# Altium project Door Sensor PCB.PrjPcb
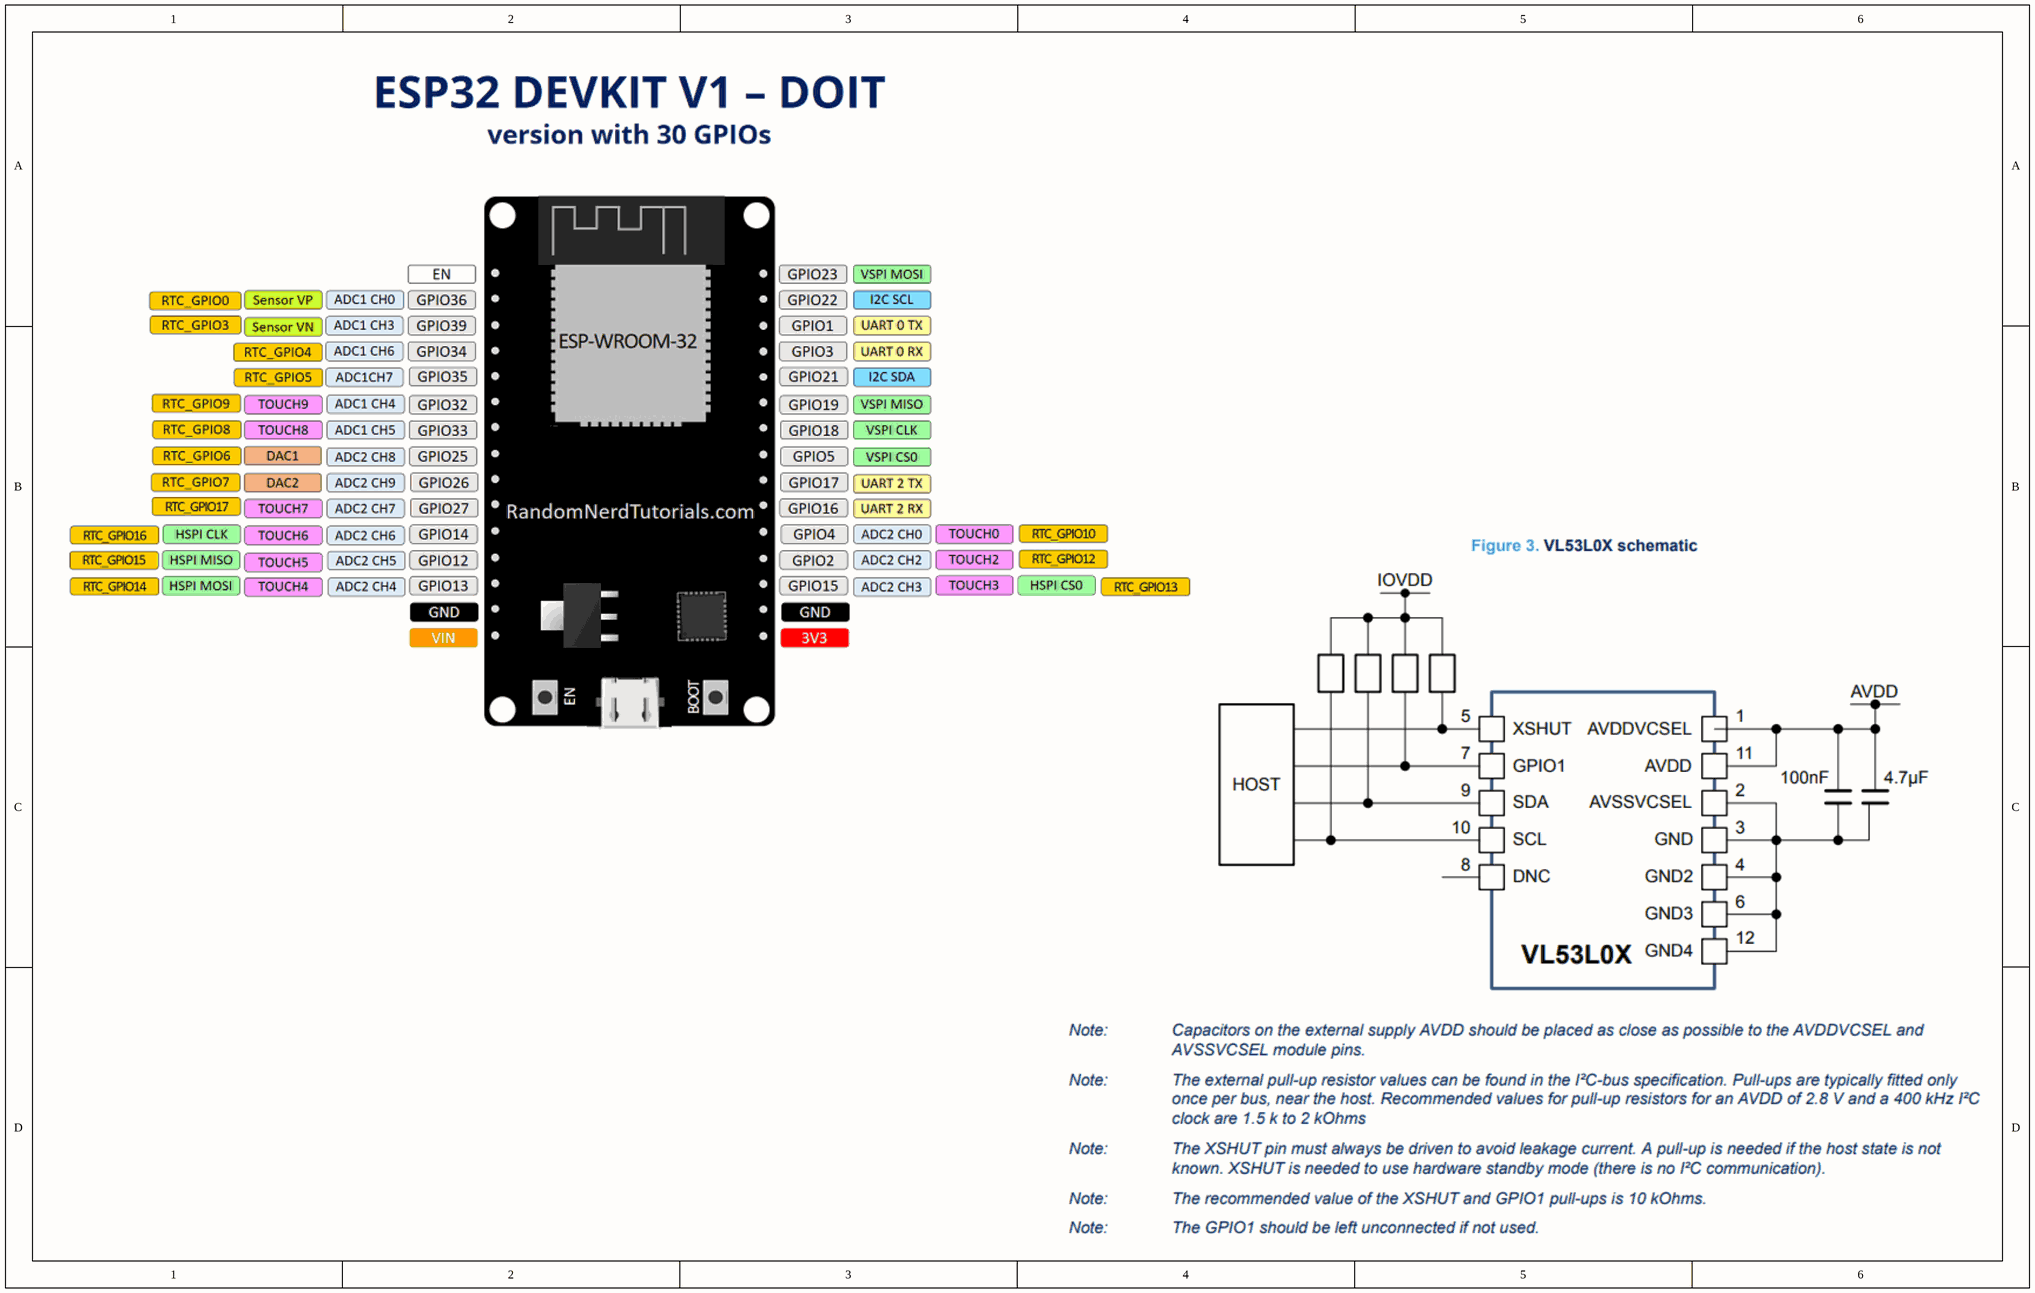
[diagram p0: Overview.SchDoc]
4 sheets, 47 parts. Net scope: global (net labels, ports and power ports of the same name join across sheets).
Board file: main.PcbDoc
Sheets:
  Overview.SchDoc
  ESP32 and Sensor.SchDoc
  Power.SchDoc
  Connections.SchDoc

## Sheet Overview.SchDoc
size B; SheetNumber: 1; SheetTotal: 4

## Sheet ESP32 and Sensor.SchDoc
size B; SheetNumber: 2; SheetTotal: 4
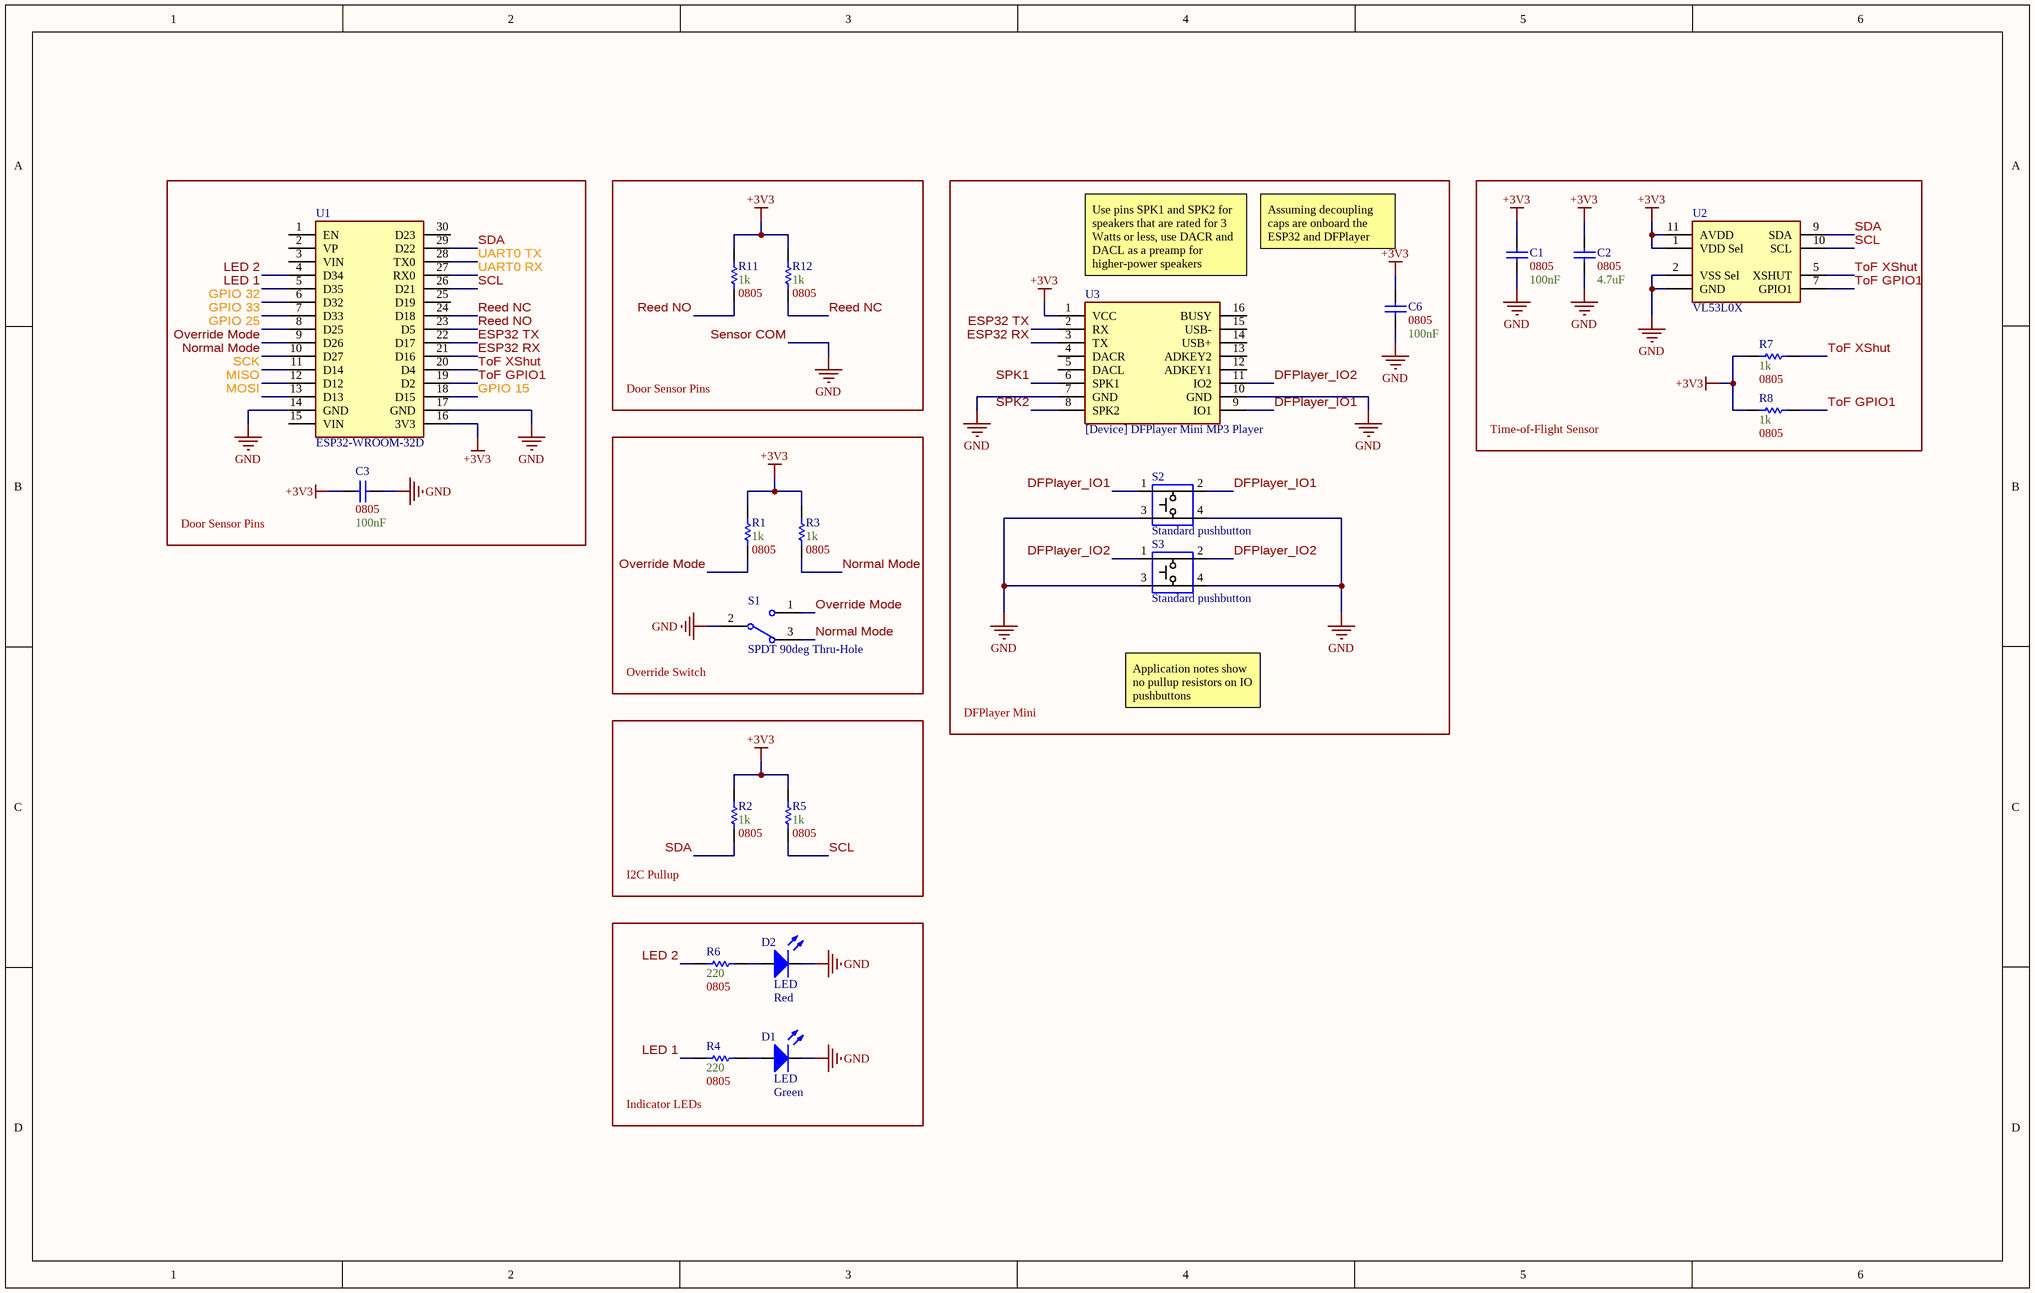
[diagram p1: ESP32 and Sensor.SchDoc]

### Parts
(Parts that share a designator on the sheet are numbered #1, #2 ... from top to bottom, then left to right.)
C1  Size Package: 0805  Capacitance: 100nF  [[Cap] SMD 0805]  (hidden comment: SMD Nonpolarized)
C2  Size Package: 0805  Capacitance: 4.7uF  [[Cap] SMD 0805]  (hidden comment: SMD Nonpolarized)
C3  Size Package: 0805  Capacitance: 100nF  [[Cap] SMD 0805]  (hidden comment: SMD Nonpolarized)
C6#1  Size Package: 0805  Capacitance: 100nF  [[Cap] SMD 0805]  (hidden comment: SMD Nonpolarized)
D1  LED  Color: Green  [[LED] Thru-Hole, 3mm, Green]
D2  LED  Color: Red  [[LED] Thru-Hole, 3mm, Red]
R1  Resistance: 1k  Size Package: 0805  [[Res] SMD 0805]  (hidden comment: [Res] SMD Resistor)
R2  Resistance: 1k  Size Package: 0805  [[Res] SMD 0805]  (hidden comment: [Res] SMD Resistor)
R3  Resistance: 1k  Size Package: 0805  [[Res] SMD 0805]  (hidden comment: [Res] SMD Resistor)
R4  Resistance: 220  Size Package: 0805  [[Res] SMD 0805]  (hidden comment: [Res] SMD Resistor)
R5  Resistance: 1k  Size Package: 0805  [[Res] SMD 0805]  (hidden comment: [Res] SMD Resistor)
R6  Resistance: 220  Size Package: 0805  [[Res] SMD 0805]  (hidden comment: [Res] SMD Resistor)
R7  Resistance: 1k  Size Package: 0805  [[Res] SMD 0805]  (hidden comment: [Res] SMD Resistor)
R8  Resistance: 1k  Size Package: 0805  [[Res] SMD 0805]  (hidden comment: [Res] SMD Resistor)
R11#1  Resistance: 1k  Size Package: 0805  [[Res] SMD 0805]  (hidden comment: [Res] SMD Resistor)
R12#1  Resistance: 1k  Size Package: 0805  [[Res] SMD 0805]  (hidden comment: [Res] SMD Resistor)
S1  SPDT 90deg Thru-Hole  [[Switch] SPDT Toggle Switch 90deg]
S2  Standard pushbutton  [[Switch] Pushbutton]
S3  Standard pushbutton  [[Switch] Pushbutton]
U1  ESP32-WROOM-32D  [[Device] ESP32-WROOM-32D]
U2#1  VL53L0X  [[Device] Time-of-Flight Sensor]
U3  [Device] DFPlayer Mini MP3 Player  [[Device] DFPlayer Mini MP3 Player]

### Blocks framed on the sheet
Door Sensor Pins: C3 U1
Door Sensor Pins: R11#1 R12#1
DFPlayer Mini: C6#1 S2 S3 U3
Time-of-Flight Sensor: C1 C2 R7 R8 U2#1
Override Switch: R1 R3 S1
I2C Pullup: R2 R5
Indicator LEDs: D1 D2 R4 R6

### Nets
+3V3: C1.2 C2.2 C3.2 C6#1.2 R1.2 R2.2 R3.2 R5.2 R7.2 R8.2 R11#1.2 R12#1.2 U1.16(3V3) U2#1.1(VDD_Sel) U2#1.11(AVDD) U3.1(VCC)
GND: C1.1 C2.1 C3.1 C6#1.1 D1.2(K) D2.2(K) S1.2 S2.3 S2.4 S3.3 S3.4 U1.14(GND) U1.17(GND) U2#1.2(VSS_Sel) U2#1.GND U3.7(GND) U3.10(GND)  [also labelled Sensor COM]
DFPlayer_IO1: S2.1 S2.2 U3.9(IO1)
DFPlayer_IO2: S3.1 S3.2 U3.11(IO2)
ESP32 RX: U1.21(D16) U3.3(TX)
ESP32 TX: U1.22(D17) U3.2(RX)
GPIO 15: U1.18(D15)
GPIO 25: U1.8(D25)
GPIO 32: U1.6(D32)
GPIO 33: U1.7(D33)
LED 1: R4.1 U1.5(D35)
LED 2: R6.1 U1.4(D34)
MISO: U1.12(D12)
MOSI: U1.13(D13)
Normal Mode: R3.1 S1.3 U1.10(D27)
Override Mode: R1.1 S1.1 U1.9(D26)
Reed NC: R12#1.1 U1.24(D18)
Reed NO: R11#1.1 U1.23(D5)
SCK: U1.11(D14)
SCL: R5.1 U1.26(D21) U2#1.10(SCL)
SDA: R2.1 U1.29(D22) U2#1.9(SDA)
SPK1: U3.6(SPK1)
SPK2: U3.8(SPK2)
ToF GPIO1: R8.1 U1.19(D2) U2#1.7(GPIO1)
ToF XShut: R7.1 U1.20(D4) U2#1.5(XSHUT)
UART0 RX: U1.27(RX0)
UART0 TX: U1.28(TX0)
NetD1_1: D1.1(A) R4.2
NetD2_1: D2.1(A) R6.2

Not connected (* = marked no-connect by the designer): U1 1(EN) 2(VP) 3(VIN) 15(VIN) 25(D19) 30(D23); U3 4(DACR) 5(DACL) 12(ADKEY1) 13(ADKEY2) 14(USB+) 15(USB-) 16(BUSY)

### Notes on the sheet
- (near U3) Use pins SPK1 and SPK2 for speakers that are rated for 3 Watts or less, use DACR and DACL as a preamp for higher-power speakers
- Assuming decoupling caps are onboard the ESP32 and DFPlayer
- Application notes show no pullup resistors on IO pushbuttons

### Library data of the parts
C1-C3 C6#1 = [Cap] SMD Nonpolarized
D1 D2 = [LED] Thru-Hole 3mm: 3mm LED
R1-R8 R11#1 R12#1 = [Res] SMD Resistor: Generic
S1 = [Switch] SPDT Toggle Switch 90deg: 100SP1T2B4M6QE
S2 S3 = [Switch] Pushbutton
U1 = [Device] ESP32-WROOM-32D: ESP32 DEVKIT V1 - DOIT; ComponentLink1Description: Pinout; ComponentLink1URL: https://esp32.com/viewtopic.php?t=9875
U2#1 = [Device] Time-of-Flight Sensor: VL53L0CXV0DH/1
U3 = [Device] DFPlayer Mini MP3 Player: ComponentLink1Description: Datasheet; ComponentLink1URL: https://picaxe.com/docs/spe033.pdf

## Sheet Power.SchDoc
size A; SheetNumber: 3; SheetTotal: 4
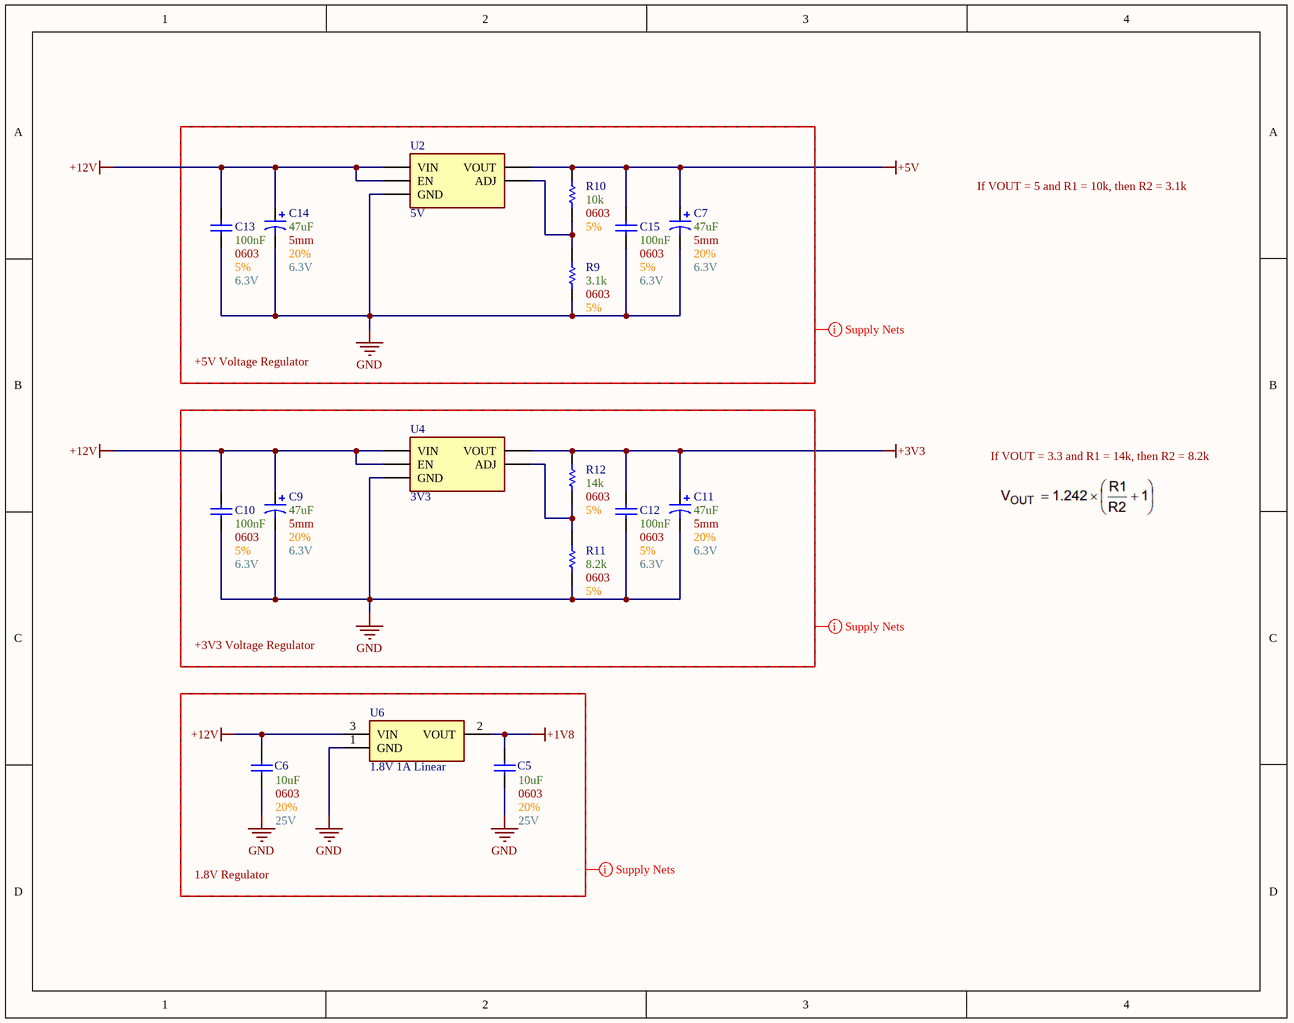
[diagram p2: Power.SchDoc]

### Parts
(Parts that share a designator on the sheet are numbered #1, #2 ... from top to bottom, then left to right.)
C5  Voltage: 25V  Tolerance: 20%  Size Package: 0603  Capacitance: 10uF  [[Cap] SMD 0603]  (hidden comment: SMD Nonpolarized)
C6#2  Voltage: 25V  Tolerance: 20%  Size Package: 0603  Capacitance: 10uF  [[Cap] SMD 0603]  (hidden comment: SMD Nonpolarized)
C7  Capacitance: 47uF  Diameter: 5mm  Tolerance: 20%  Max Voltage: 6.3V  [[Cap] SMD Polarized, 5mm]  (hidden comment: SMD Polarized)
C9  Capacitance: 47uF  Diameter: 5mm  Tolerance: 20%  Max Voltage: 6.3V  [[Cap] SMD Polarized, 5mm]  (hidden comment: SMD Polarized)
C10  Size Package: 0603  Capacitance: 100nF  Voltage: 6.3V  Tolerance: 5%  [[Cap] SMD 0603]  (hidden comment: [Cap] SMD Nonpolarized)
C11  Capacitance: 47uF  Diameter: 5mm  Tolerance: 20%  Max Voltage: 6.3V  [[Cap] SMD Polarized, 5mm]  (hidden comment: SMD Polarized)
C12  Size Package: 0603  Capacitance: 100nF  Voltage: 6.3V  Tolerance: 5%  [[Cap] SMD 0603]  (hidden comment: [Cap] SMD Nonpolarized)
C13  Size Package: 0603  Capacitance: 100nF  Voltage: 6.3V  Tolerance: 5%  [[Cap] SMD 0603]  (hidden comment: [Cap] SMD Nonpolarized)
C14  Capacitance: 47uF  Diameter: 5mm  Tolerance: 20%  Max Voltage: 6.3V  [[Cap] SMD Polarized, 5mm]  (hidden comment: SMD Polarized)
C15  Size Package: 0603  Capacitance: 100nF  Voltage: 6.3V  Tolerance: 5%  [[Cap] SMD 0603]  (hidden comment: [Cap] SMD Nonpolarized)
R9  Tolerance: 5%  Resistance: 3.1k  Size Package: 0603  [[Res] SMD 0603]  (hidden comment: [Res] SMD Resistor)
R10  Tolerance: 5%  Resistance: 10k  Size Package: 0603  [[Res] SMD 0603]  (hidden comment: [Res] SMD Resistor)
R11#2  Tolerance: 5%  Resistance: 8.2k  Size Package: 0603  [[Res] SMD 0603]  (hidden comment: [Res] SMD Resistor)
R12#2  Tolerance: 5%  Resistance: 14k  Size Package: 0603  [[Res] SMD 0603]  (hidden comment: [Res] SMD Resistor)
U2#2  5V  [[Reg] Variable Voltage Regulator]
U4  3V3  [[Reg] Variable Voltage Regulator]
U6  1.8V 1A Linear  [[Reg] 1.8V Regulator]

### Blocks framed on the sheet
+5V Voltage Regulator: C7 C13-C15 R9 R10 U2#2
+3V3 Voltage Regulator: C9-C12 R11#2 R12#2 U4
1.8V Regulator: C5 C6#2 U6

### Nets
+1V8: C5.2 U6.2(VOUT)
+3V3: C11.1 C12.2 R12#2.2 U4.4(VOUT)
+5V: C7.1 C15.2 R10.2 U2#2.4(VOUT)
+12V: C6#2.2 C9.1 C10.2 C13.2 C14.1 U2#2.1(EN) U2#2.2(VIN) U4.1(EN) U4.2(VIN) U6.3(VIN)
GND: C5.1 C6#2.1 C7.2 C9.2 C10.1 C11.2 C12.1 C13.1 C14.2 C15.1 R9.1 R11#2.1 U2#2.3(GND) U4.3(GND) U6.1(GND)
NetR9_2: R9.2 R10.1 U2#2.5(ADJ)
NetR11#2_2: R11#2.2 R12#2.1 U4.5(ADJ)

### Layout directives
net class Supply_Nets: +1V8, +12V, GND

### Notes on the sheet
- If VOUT = 5 and R1 = 10k, then R2 = 3.1k
- If VOUT = 3.3 and R1 = 14k, then R2 = 8.2k

### Library data of the parts
C5 C6#2 = [Cap] SMD Nonpolarized: Supplier 1: DigiKey; Supplier Part Number 1: 1276-1869-1-ND
C7 C9 C11 C14 = [Cap] SMD Polarized: Supplier 1: DigiKey; Supplier Part Number 1: 493-2152-1-ND
R9 R10 R11#2 R12#2 = [Res] SMD Resistor: Generic; Supplier 1: DigiKey
  R9: Supplier Part Number 1: 311-3.16KHRCT-ND
  R10: Supplier Part Number 1: 311-10.0KHRDKR-ND
  R11#2: Supplier Part Number 1: 311-8.2KGRCT-ND
  R12#2: Supplier Part Number 1: RMCF0603FT14K0DKR-ND
U2#2 U4 = [Reg] Variable Voltage Regulator: MIC29302WT; Supplier 1: DigiKey; Supplier Part Number 1: 576-1124-ND
U6 = [Reg] 1.8V Regulator: NCP1117IST18T3G; Supplier 1: DigiKey; Supplier Part Number 1: 488-NCP1117IST18T3GCT-ND
C10 C12 C13 C15 = [Cap] SMD Nonpolarized: Supplier 1: DigiKey; Supplier Part Number 1: 311-1088-6-ND

## Sheet Connections.SchDoc
size A; SheetNumber: 4; SheetTotal: 4
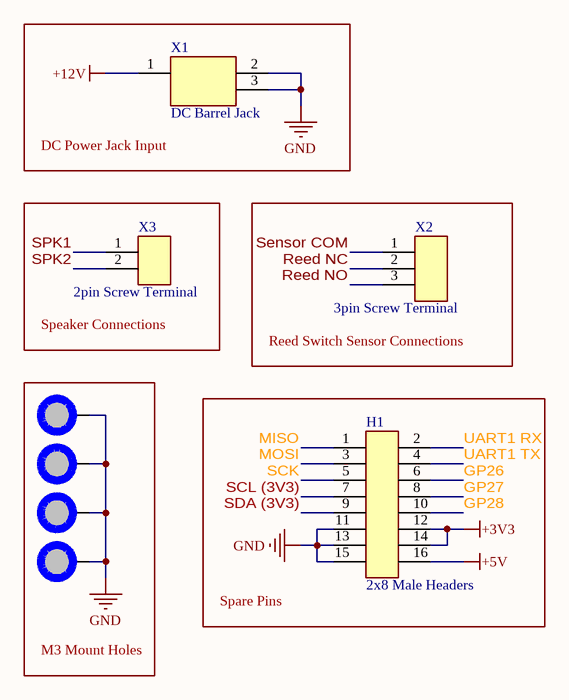
[diagram p3: Connections.SchDoc]

### Parts
H1  2x8 Male Headers  [[Header] 2x8 Male Headers]
Mount1  M3 Mount Hole  [[Mount] M3 Mount Hole]  (value not drawn)  (no BOM)
Mount2  M3 Mount Hole  [[Mount] M3 Mount Hole]  (value not drawn)  (no BOM)
Mount3  M3 Mount Hole  [[Mount] M3 Mount Hole]  (value not drawn)  (no BOM)
Mount4  M3 Mount Hole  [[Mount] M3 Mount Hole]  (value not drawn)  (no BOM)
X1  DC Barrel Jack  [[Port] DC Barrel Jack]
X2  3pin Screw Terminal  [[Screw Terminal] 3pin 5mm]
X3  2pin Screw Terminal  [[Screw Terminal] 2pin 5mm]

### Blocks framed on the sheet
DC Power Jack Input: X1
Speaker Connections: X3
Reed Switch Sensor Connections: X2
M3 Mount Holes: Mount1-Mount4
Spare Pins: H1

### Nets
+3V3: H1.12 H1.14
+5V: H1.16
+12V: X1.1(Pin)
GND: H1.11 H1.13 H1.15 Mount1.1 Mount2.1 Mount3.1 Mount4.1 X1.2(Barrel) X1.3(Barrel) X2.1  [also labelled Sensor COM]
GP26: H1.6
GP27: H1.8
GP28: H1.10
MISO: H1.1
MOSI: H1.3
Reed NC: X2.2
Reed NO: X2.3
SCK: H1.5
SCL (3V3): H1.7
SDA (3V3): H1.9
SPK1: X3.1
SPK2: X3.2
UART1 RX: H1.2
UART1 TX: H1.4

### Library data of the parts
H1 = [Header] 2x8 Male: 2.54mm pitch
Mount1-Mount4 = [Mount] M3 Mount Hole: Place at least 4.5mm from board edge. Plated.
X1 = [Port] DC Barrel Jack: Pin 1: Pin / Pin2/3: Barrel; Supplier 1: DigiKey; Supplier Part Number 1: CP-102A-ND
X2 = [Screw Terminal] 3pin: Supplier 1: DigiKey; Supplier Part Number 1: 102-6162-ND
X3 = [Screw Terminal] 2pin: Supplier 1: DigiKey; Supplier Part Number 1: 102-6145-ND

## Nets that join several sheets
+3V3: ESP32 and Sensor (16 pins), Power (C11.1 C12.2 R12#2.2 U4.4), Connections (H1.12 H1.14)
+5V: Power (C7.1 C15.2 R10.2 U2#2.4), Connections (H1.16)
+12V: Power (10 pins), Connections (X1.1)
GND: ESP32 and Sensor (17 pins), Power (15 pins), Connections (10 pins)
MISO: ESP32 and Sensor (U1.12), Connections (H1.1)
MOSI: ESP32 and Sensor (U1.13), Connections (H1.3)
Reed NC: ESP32 and Sensor (R12#1.1 U1.24), Connections (X2.2)
Reed NO: ESP32 and Sensor (R11#1.1 U1.23), Connections (X2.3)
SCK: ESP32 and Sensor (U1.11), Connections (H1.5)
SPK1: ESP32 and Sensor (U3.6), Connections (X3.1)
SPK2: ESP32 and Sensor (U3.8), Connections (X3.2)